# EAGLE design IFE_TSAL_Light_2019_v1.0 (EAGLE 9.2.2)
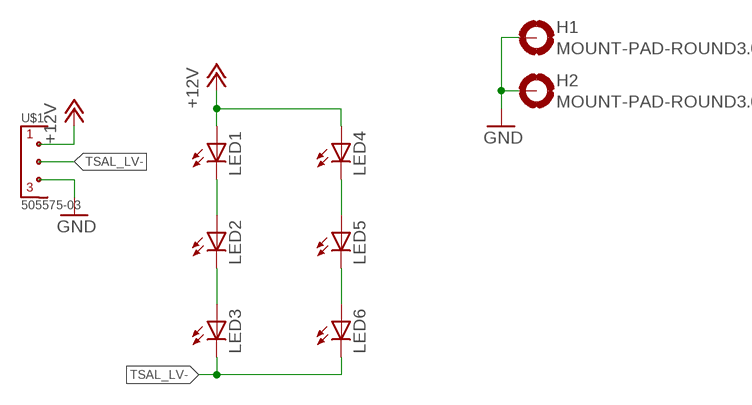
[diagram p0: schematic, sheet 1]

## Parts
H1  MOUNT-PAD-ROUND3.0  [3,0-PAD]
H2  MOUNT-PAD-ROUND3.0  [3,0-PAD]
LED1  LED5MM  [LED5MM]
LED2  LED5MM  [LED5MM]
LED3  LED5MM  [LED5MM]
LED4  LED5MM  [LED5MM]
LED5  LED5MM  [LED5MM]
LED6  LED5MM  [LED5MM]
U$1  505575-03  [505575-03]

## Nets
+12V: LED1.A LED4.A U$1.1
GND: H1.B3,0(MOUNT) H2.B3,0(MOUNT) U$1.3
N$2: LED1.K(C) LED2.A
N$3: LED2.K(C) LED3.A
N$7: LED4.K(C) LED5.A
N$8: LED5.K(C) LED6.A
TSAL_LV-: LED3.K(C) LED6.K(C) U$1.2

## Library data of the parts
H1 H2 = holes:MOUNT-PAD-ROUND: MOUNTING PAD, round
LED1-LED6 = led:LED: LED OSRAM: - CHIPLED LG R971, LG N971, LY N971, LG Q971, LY Q971, LO R971, LY R971 LH N974, LH R974 LS Q976, LO Q976, LY Q976 LO Q996 - Hyper CHIPLED LW Q18S LB Q993, LB Q99A, LB R99A - SideLED LS A670, LO A670, LY A670, LG A670, LP A670 LB A673, LV A673, LT A673, LW A673 LH A674 LY A675 LS A676, LA A676, LO A676, LY A676, LW A676 LS A679, LY A679, LG A679 - Hyper Micro SIDELED® LS Y876, LA Y876, LO Y876, LY Y876 LT Y87S - SmartLED LW L88C, LW L88S LB L89C, LB L89S, LG L890 LS L89K, LO L89K, LY L89K LS L896, LA L896, LO L896, LY L896 - TOPLED LS T670, LO T670, LY T670, LG T670, LP T670 LSG T670, LSP T670, LSY T670, LOP T670, LYG T670 LG T671, LOG T671, LSG T671 LB T673, LV T673, LT T673, LW T673 LH T674 LS T676, LA T676, LO T676, LY T676, LB T676, LH T676, LSB T676, LW T676 LB T67C, LV T67C, LT T67C, LS T67K, LO T67K, LY T67K, LW E67C LS E67B, LA E67B, LO E67B, LY E67B, LB E67C, LV E67C, LT E67C LW T67C LS T679, LY T679, LG T679 LS T770, LO T770, LY T770, LG T770, LP T770 LB T773, LV T773, LT T773, LW T773 LH T774 LS E675, LA E675, LY E675, LS T675 LS T776, LA T776, LO T776, LY T776, LB T776 LHGB T686 LT T68C, LB T68C - Hyper Mini TOPLED® LB M676 - Mini TOPLED Santana® LG M470 LS M47K, LO M47K, LY M47K Source: http://www.osram.convergy.de LUXEON: - LUMILED® LXK2-PW12-R00, LXK2-PW12-S00, LXK2-PW14-U00, LXK2-PW14-V00 LXK2-PM12-R00, LXK2-PM12-S00, LXK2-PM14-U00 LXK2-PE12-Q00, LXK2-PE12-R00, LXK2-PE12-S00, LXK2-PE14-T00, LXK2-PE14-U00 LXK2-PB12-K00, LXK2-PB12-L00, LXK2-PB12-M00, LXK2-PB14-N00, LXK2-PB14-P00, LXK2-PB14-Q00 LXK2-PR12-L00, LXK2-PR12-M00, LXK2-PR14-Q00, LXK2-PR14-R00 LXK2-PD12-Q00, LXK2-PD12-R00, LXK2-PD12-S00 LXK2-PH12-R00, LXK2-PH12-S00 LXK2-PL12-P00, LXK2-PL12-Q00, LXK2-PL12-R00 Source: www.luxeon.com KINGBRIGHT: KA-3528ASYC Source: www.kingbright.com
U$1 = MOLEX:505575-03: Molex 505575-03 3 Position 2.00mm pitch connector wire to board connector Datasheet <https://www.molex.com/pdm_docs/sd/5055750271_sd.pdf>

## Board
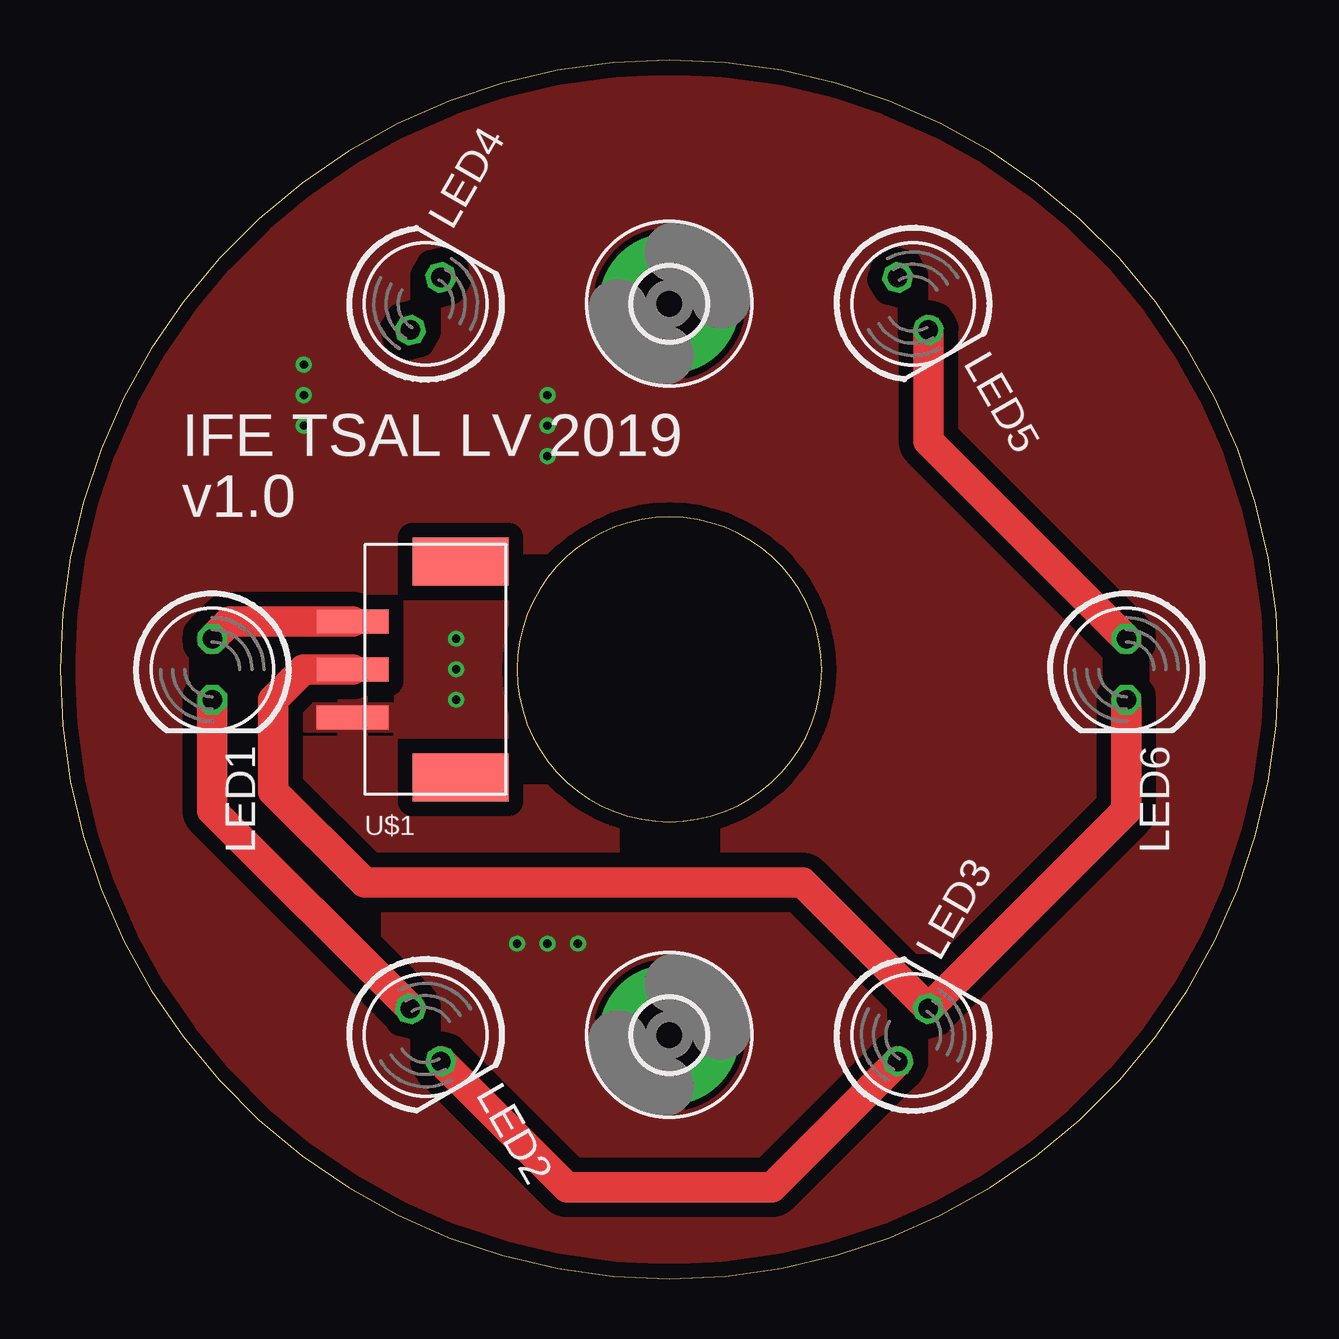
[diagram p1: board, top side]
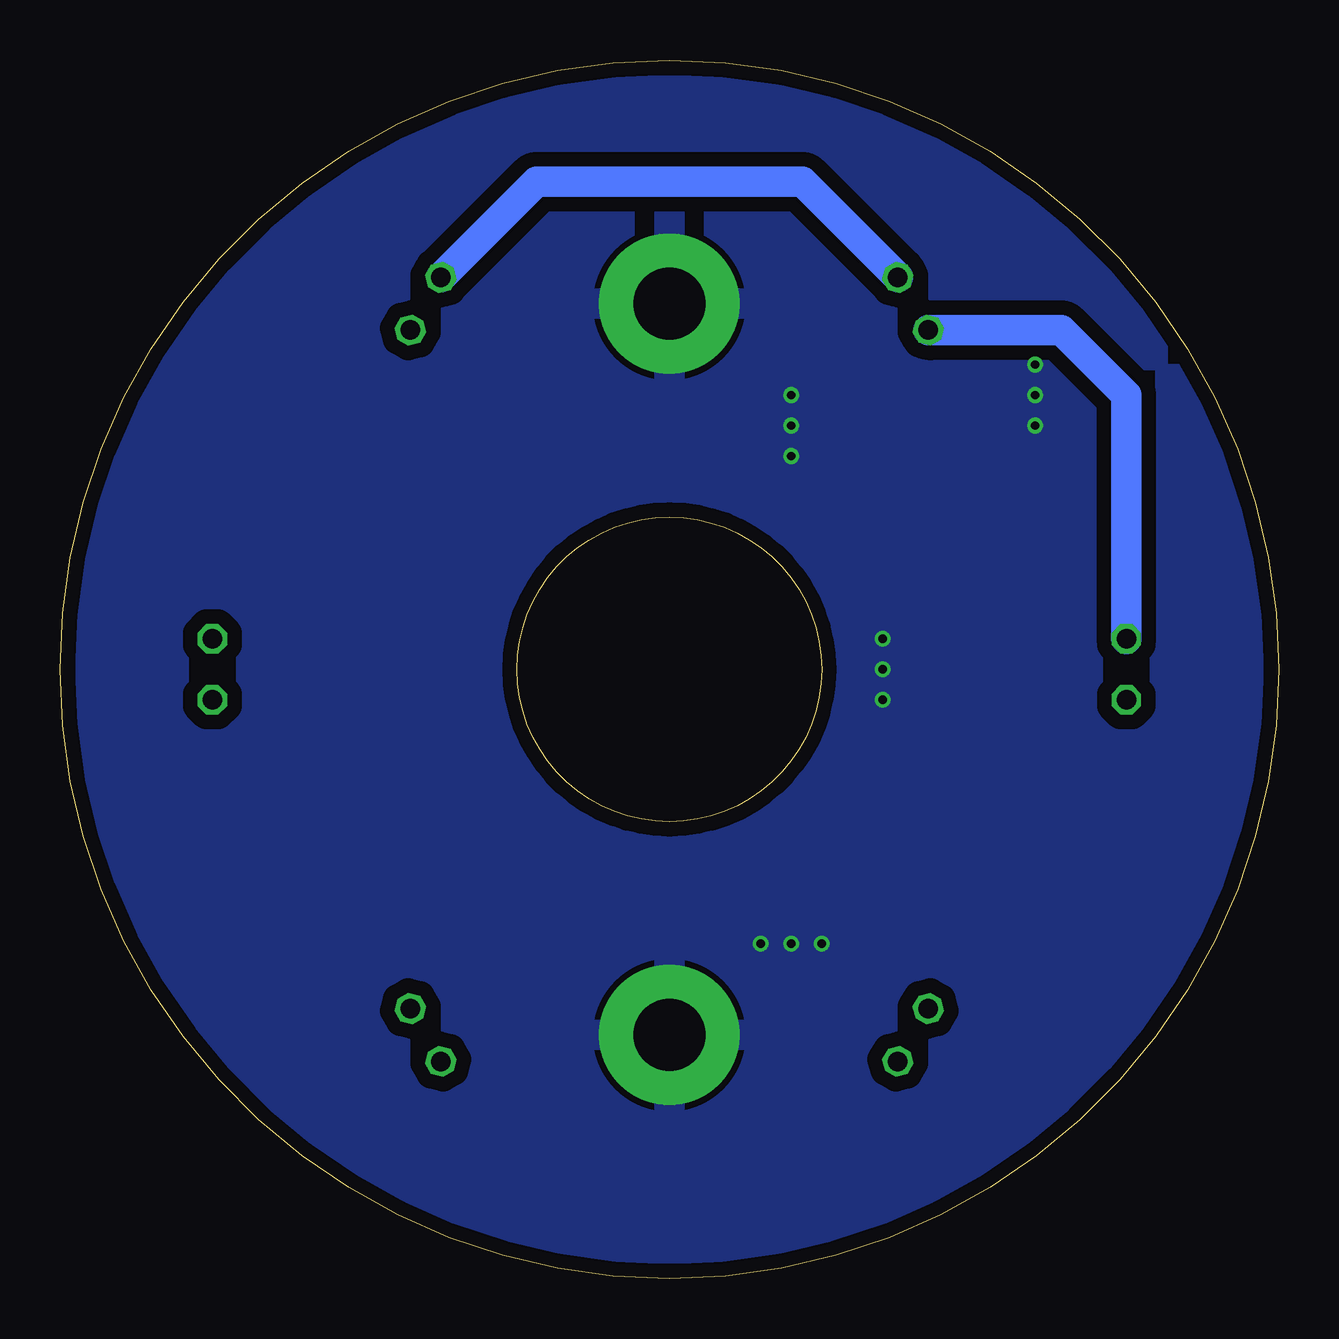
[diagram p2: board, bottom side, seen from below]

Size 50.8 x 50.8 mm. Coordinates in mm from the lower left corner, seen from the top.
Outline: 25.4,50.8 arc90 0,25.4 arc90 25.4,0 arc90 50.8,25.4 arc90 25.4,50.8
Outline: 25.4,31.75 arc90 19.05,25.4 arc90 25.4,19.05 arc90 31.75,25.4 arc90 25.4,31.75
Copper layers (1*16): Top 0.035mm / dielectric 1.6mm / Bottom 0.035mm
Design rules "Elecrow_2-layer_PCB_eagle_rule": minimum track width 6mil, minimum drill 12mil, track to track 6mil, track to pad 6mil, pad to pad 6mil, via to via 8mil, smd to smd 0mil, copper to edge 20mil, drill to drill 10mil, minimum pad ring 6mil, minimum via ring 6mil, stop-mask expansion 0mil, vias tented up to drill 100mil, thermal gap 10mil

### Footprints (pad centres in the part's own frame; a part is rotated, then mirrored left to right if it is on the bottom)
3,0-PAD = drill 3 pad 5.842: B3,0 0,0
LED5MM = drill 0.813 octagon: A -1.27,0; K 1.27,0
505575-03 = smd 1 x 3: 1 -2,-0.5; 2 0,-0.5; 3 2,-0.5 | smd 2 x 4: P$3 -4.5,4; P$4 4.5,4

### Placement (x,y rotation side)
H1  25.4,40.64 0 top
H2  25.4,10.16 0 top
LED1  6.35,25.4 270 top
LED2  15.24,10.16 300 top
LED3  35.56,10.16 60 top
LED4  15.24,40.64 60 top
LED5  35.56,40.64 300 top
LED6  44.45,25.4 270 top
U$1  12.7,25.4 270 top

### Tracks (layer width: path | path; a pad name or v marks a point on that pad's centre or on a via)
+12V
  Top 1.27: LED1.A 7.08,27.4 U$1.1
  Bottom 1.27: LED1.A 6.35,36.83 9.06,39.54 LED4.A
GND  (via drill 0.35)
  other vias: 10.16,38.1 10.16,36.83 10.16,35.56 20.32,36.83 20.32,35.56 20.32,34.29 16.51,26.67 16.51,25.4 16.51,24.13 19.05,13.97 20.32,13.97 21.59,13.97
  pour Top (isolate 0.61): 0,50.8 50.8,50.8 50.8,0 0,0
  pour Bottom (isolate 0.61): 0,50.8 50.8,50.8 50.8,0 0,0
N$2
  Top 1.27: LED2.A 6.35,19.52 LED1.K
N$3
  Top 1.27: LED3.A 29.68,3.81 21.12,3.81 LED2.K
N$7
  Bottom 1.27: LED4.K 19.86,45.72 30.95,45.72 LED5.A
N$8
  Top 1.27: LED5.K 36.2,34.92 LED6.A
TSAL_LV-
  Top 1.27: LED6.K 44.45,19.52 LED3.K 30.95,16.51 12.7,16.51 8.89,20.32 8.89,24.13 10.16,25.4 U$1.2

### Text on the board
tNames: IFE TSAL LV 2019 | v1.0